# EAGLE design shift octal driver (EAGLE 5.12)
FARNELL: http://uk.farnell.com/nxp/74hct595d/shift-reg-sipo-siso-8bit-16soic/dp/2098004; PARTNO: MCCA000416
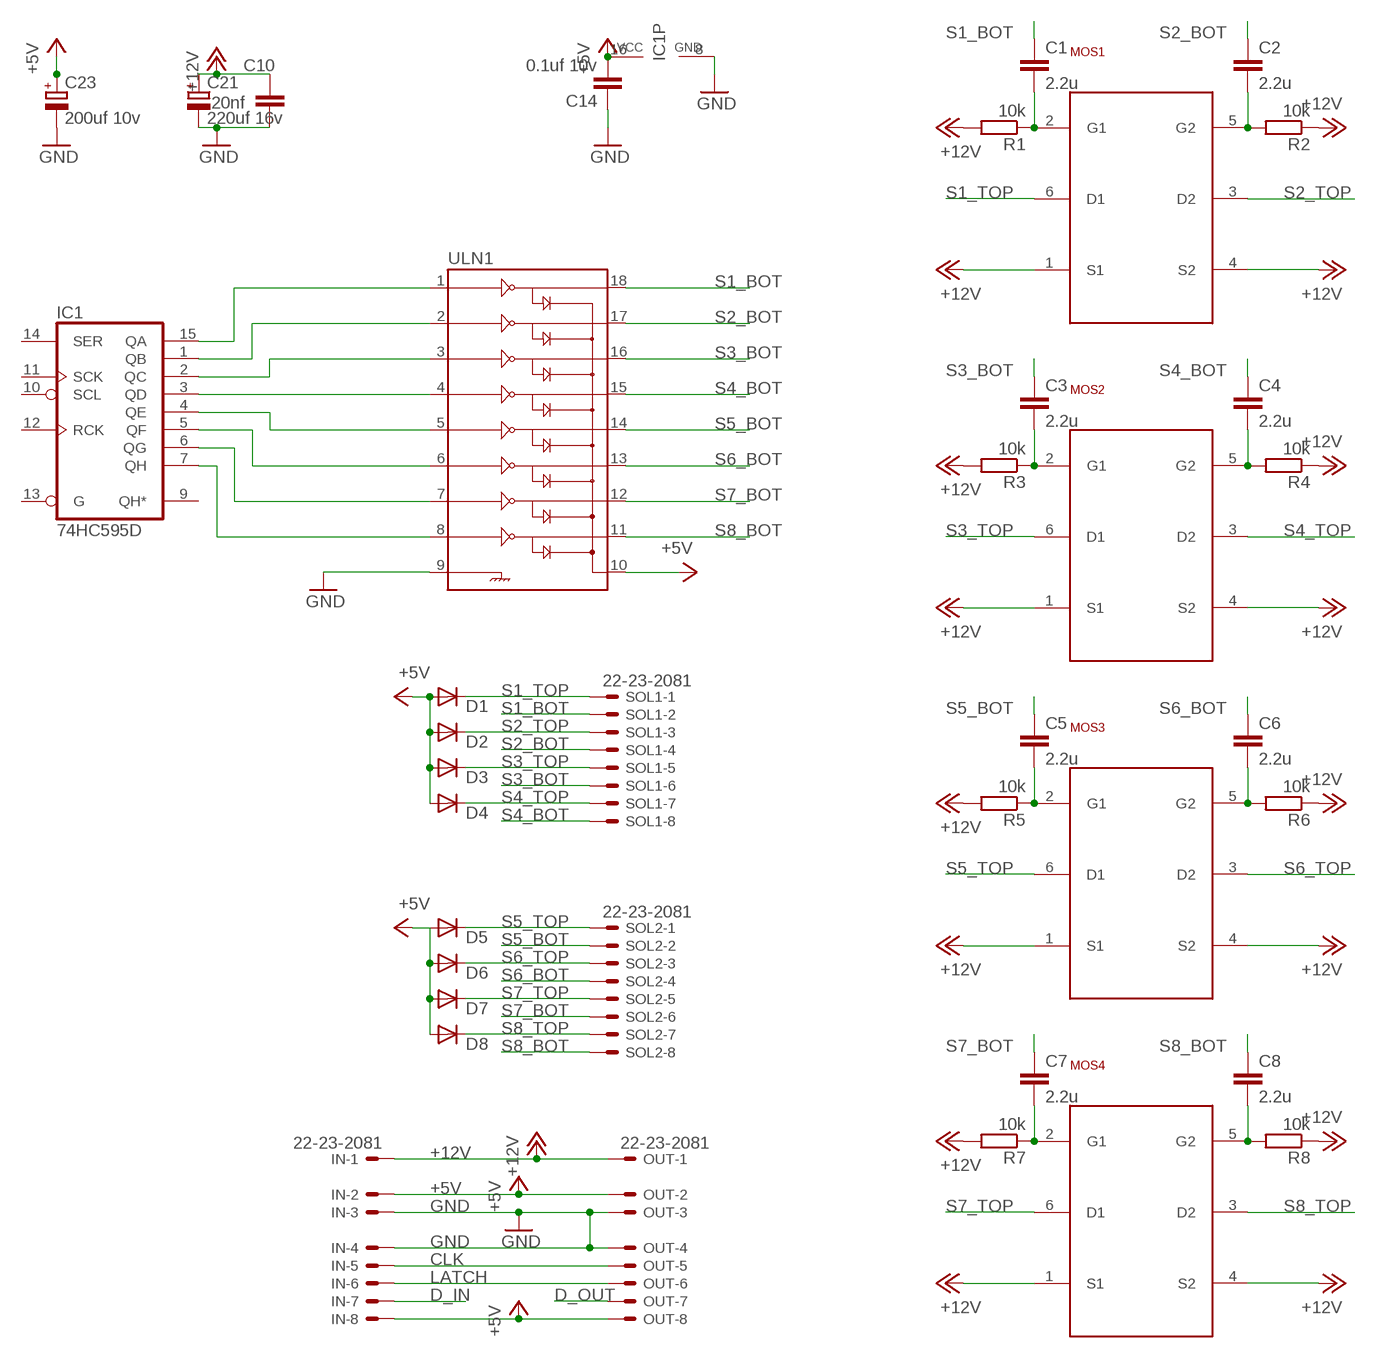
[diagram p0: schematic, sheet 1]

## Parts
C1  2.2u  C-EUC1206  [C1206]
C2  2.2u  C-EUC1206  [C1206]
C3  2.2u  C-EUC1206  [C1206]
C4  2.2u  C-EUC1206  [C1206]
C5  2.2u  C-EUC1206  [C1206]
C6  2.2u  C-EUC1206  [C1206]
C7  2.2u  C-EUC1206  [C1206]
C8  2.2u  C-EUC1206  [C1206]
C10  20nf  C-EUC1206  [C1206]
C14  0.1uf 10v  C-EUC1206  [C1206]
C21  220uf 16v  CPOL-EU153CLV-0810  [153CLV-0810]
C23  200uf 10v  CPOL-EU153CLV-0505  [153CLV-0505]
D1  DIODE-SOD323-W  [SOD323-W]
D2  DIODE-SOD323-W  [SOD323-W]
D3  DIODE-SOD323-W  [SOD323-W]
D4  DIODE-SOD323-W  [SOD323-W]
D5  DIODE-SOD323-W  [SOD323-W]
D6  DIODE-SOD323-W  [SOD323-W]
D7  DIODE-SOD323-W  [SOD323-W]
D8  DIODE-SOD323-W  [SOD323-W]
IC1  74HC595D  [SO16]
IN  22-23-2081  [22-23-2081]
MOS1  PMDT670UPE  [SOT666]
MOS2  PMDT670UPE  [SOT666]
MOS3  PMDT670UPE  [SOT666]
MOS4  PMDT670UPE  [SOT666]
OUT  22-23-2081  [22-23-2081]
R1  10k  R-EU_R1206  [R1206]
R2  10k  R-EU_R1206  [R1206]
R3  10k  R-EU_R1206  [R1206]
R4  10k  R-EU_R1206  [R1206]
R5  10k  R-EU_R1206  [R1206]
R6  10k  R-EU_R1206  [R1206]
R7  10k  R-EU_R1206  [R1206]
R8  10k  R-EU_R1206  [R1206]
SOL1  22-23-2081  [22-23-2081]
SOL2  22-23-2081  [22-23-2081]
ULN1  ULN2803SOIC  [SO018]

## Nets
+5V [power]: C14.2 C23.+ D1.A D2.A D3.A D4.A D5.A D6.A D7.A D8.A IC1.16(VCC) IN.2 IN.8 OUT.2 OUT.8 ULN1.10
+12V [power]: C10.1 C21.+ IN.1 MOS1.1(S1) MOS1.4(S2) MOS2.1(S1) MOS2.4(S2) MOS3.1(S1) MOS3.4(S2) MOS4.1(S1) MOS4.4(S2) OUT.1 R1.2 R2.1 R3.2 R4.1 R5.2 R6.1 R7.2 R8.1
CLK: IN.5 OUT.5
D_IN: IN.7
D_OUT: OUT.7
GND [gnd]: C10.2 C14.1 C21.- C23.- IC1.8(GND) IN.3 IN.4 OUT.3 OUT.4 ULN1.9
LATCH: IN.6 OUT.6
N$1: IC1.15(QA) ULN1.1
N$2: IC1.1(QB) ULN1.2
N$3: IC1.2(QC) ULN1.3
N$4: IC1.3(QD) ULN1.4
N$5: IC1.4(QE) ULN1.5
N$6: IC1.5(QF) ULN1.6
N$7: IC1.6(QG) ULN1.7
N$8: IC1.7(QH) ULN1.8
N$9: C1.2 MOS1.2(G1) R1.1
N$10: C2.2 MOS1.5(G2) R2.2
N$11: C3.2 MOS2.2(G1) R3.1
N$12: C4.2 MOS2.5(G2) R4.2
N$13: C5.2 MOS3.2(G1) R5.1
N$14: C6.2 MOS3.5(G2) R6.2
N$15: C7.2 MOS4.2(G1) R7.1
N$16: C8.2 MOS4.5(G2) R8.2
S1_BOT: C1.1 SOL1.2 ULN1.18
S1_TOP: D1.C MOS1.6(D1) SOL1.1
S2_BOT: C2.1 SOL1.4 ULN1.17
S2_TOP: D2.C MOS1.3(D2) SOL1.3
S3_BOT: C3.1 SOL1.6 ULN1.16
S3_TOP: D3.C MOS2.6(D1) SOL1.5
S4_BOT: C4.1 SOL1.8 ULN1.15
S4_TOP: D4.C MOS2.3(D2) SOL1.7
S5_BOT: C5.1 SOL2.2 ULN1.14
S5_TOP: D5.C MOS3.6(D1) SOL2.1
S6_BOT: C6.1 SOL2.4 ULN1.13
S6_TOP: D6.C MOS3.3(D2) SOL2.3
S7_BOT: C7.1 SOL2.6 ULN1.12
S7_TOP: D7.C MOS4.6(D1) SOL2.5
S8_BOT: C8.1 SOL2.8 ULN1.11
S8_TOP: D8.C MOS4.3(D2) SOL2.7
Unconnected: IC1.9(QH*) IC1.10(SCL) IC1.11(SCK) IC1.12(RCK) IC1.13(G) IC1.14(SER)

## Library data of the parts
C1-C8 = matt rcl:C-EU: CAPACITOR, European symbol
C10 C14 = resistor:C-EU: CAPACITOR, European symbol
C21 = matt rcl:CPOL-EU: POLARIZED CAPACITOR, European symbol
C23 = rcl:CPOL-EU: POLARIZED CAPACITOR, European symbol
D1-D8 = matt diode:DIODE-: DIODE
IC1 = 74xx-eu:74*595: 8-bit SHIFT REGISTER, output latch
IN OUT SOL1 SOL2 = con-molex:22-23-2081: .100" (2.54mm) Center Header - 8 Pin; MF: MOLEX; MPN: 22-23-2081; OC_FARNELL: 1756826; OC_NEWARK: 01C7592
MOS1-MOS4 = matt:PMDT670UPE
R1-R8 = matt rcl:R-EU_: RESISTOR, European symbol
ULN1 = SparkFun:ULN2803: Darlington Driver ULN2803 Darlington array. 500mA max per channel, 8-channel package. Spark Fun Electronics SKU : COM-00312

## Net classes
1 power: width 0.508 mm
2 gnd: width 0.508 mm, drill 0.711 mm, clearance 0.203 mm

## Board
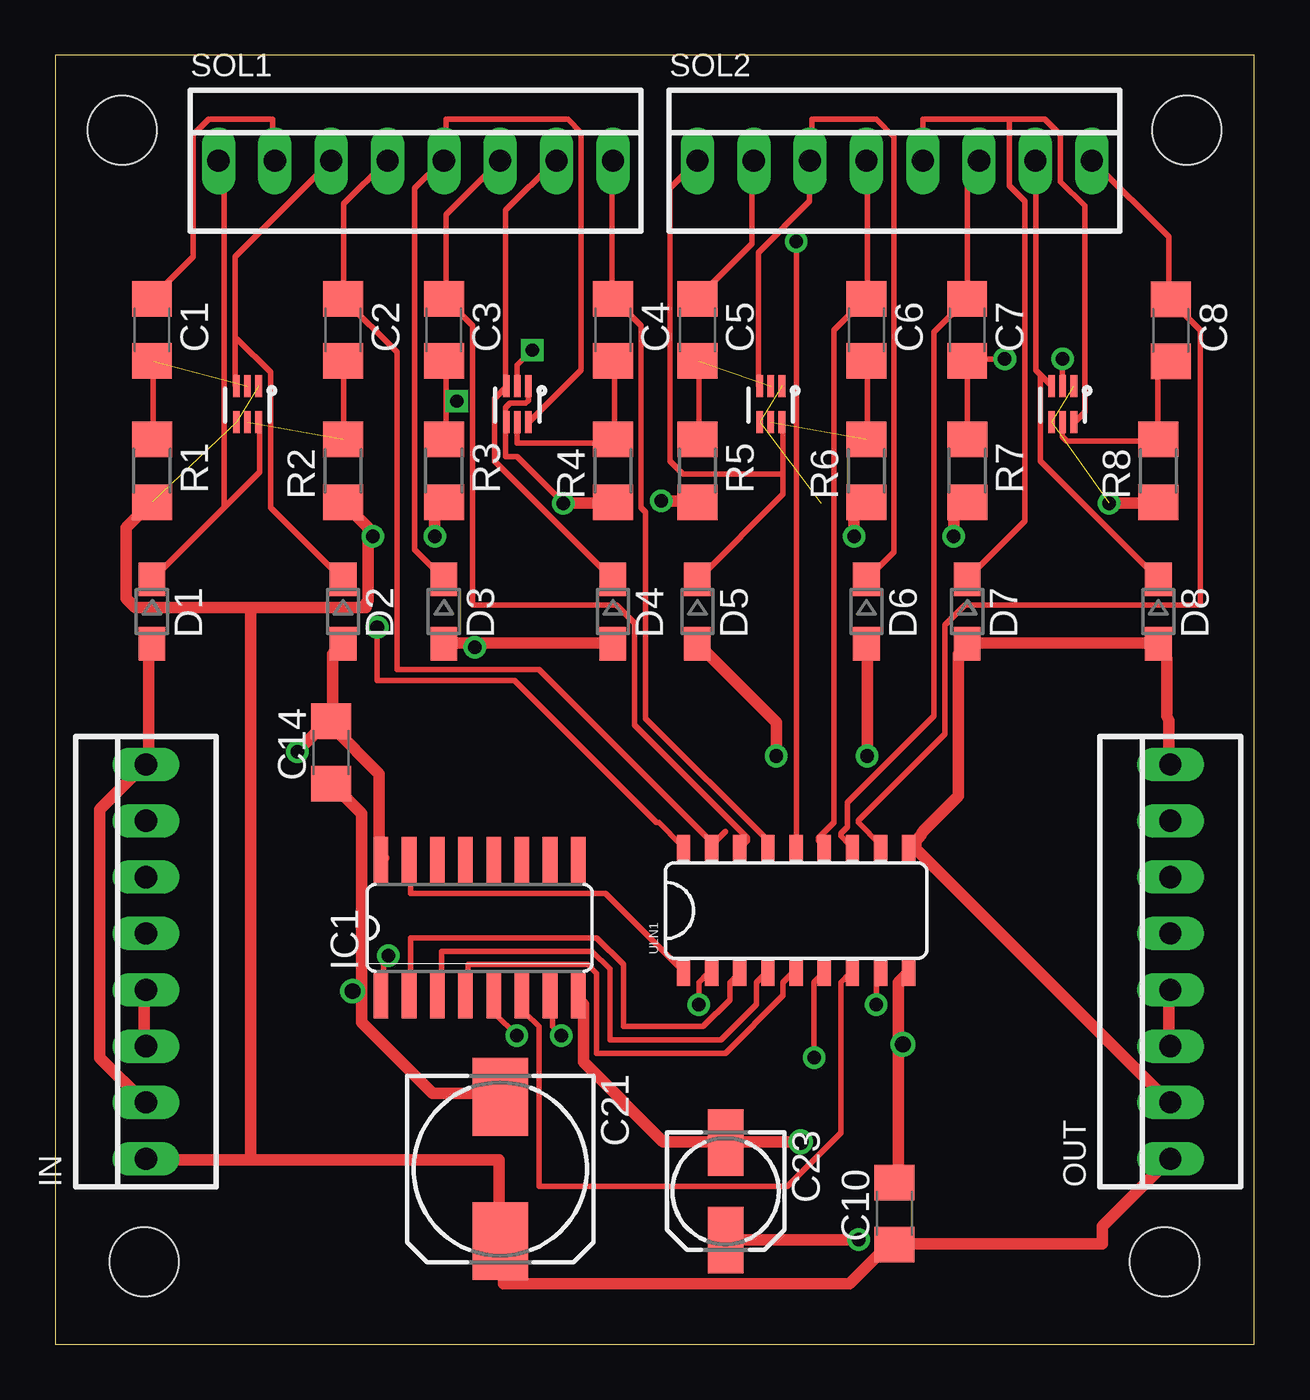
[diagram p1: board, top side]
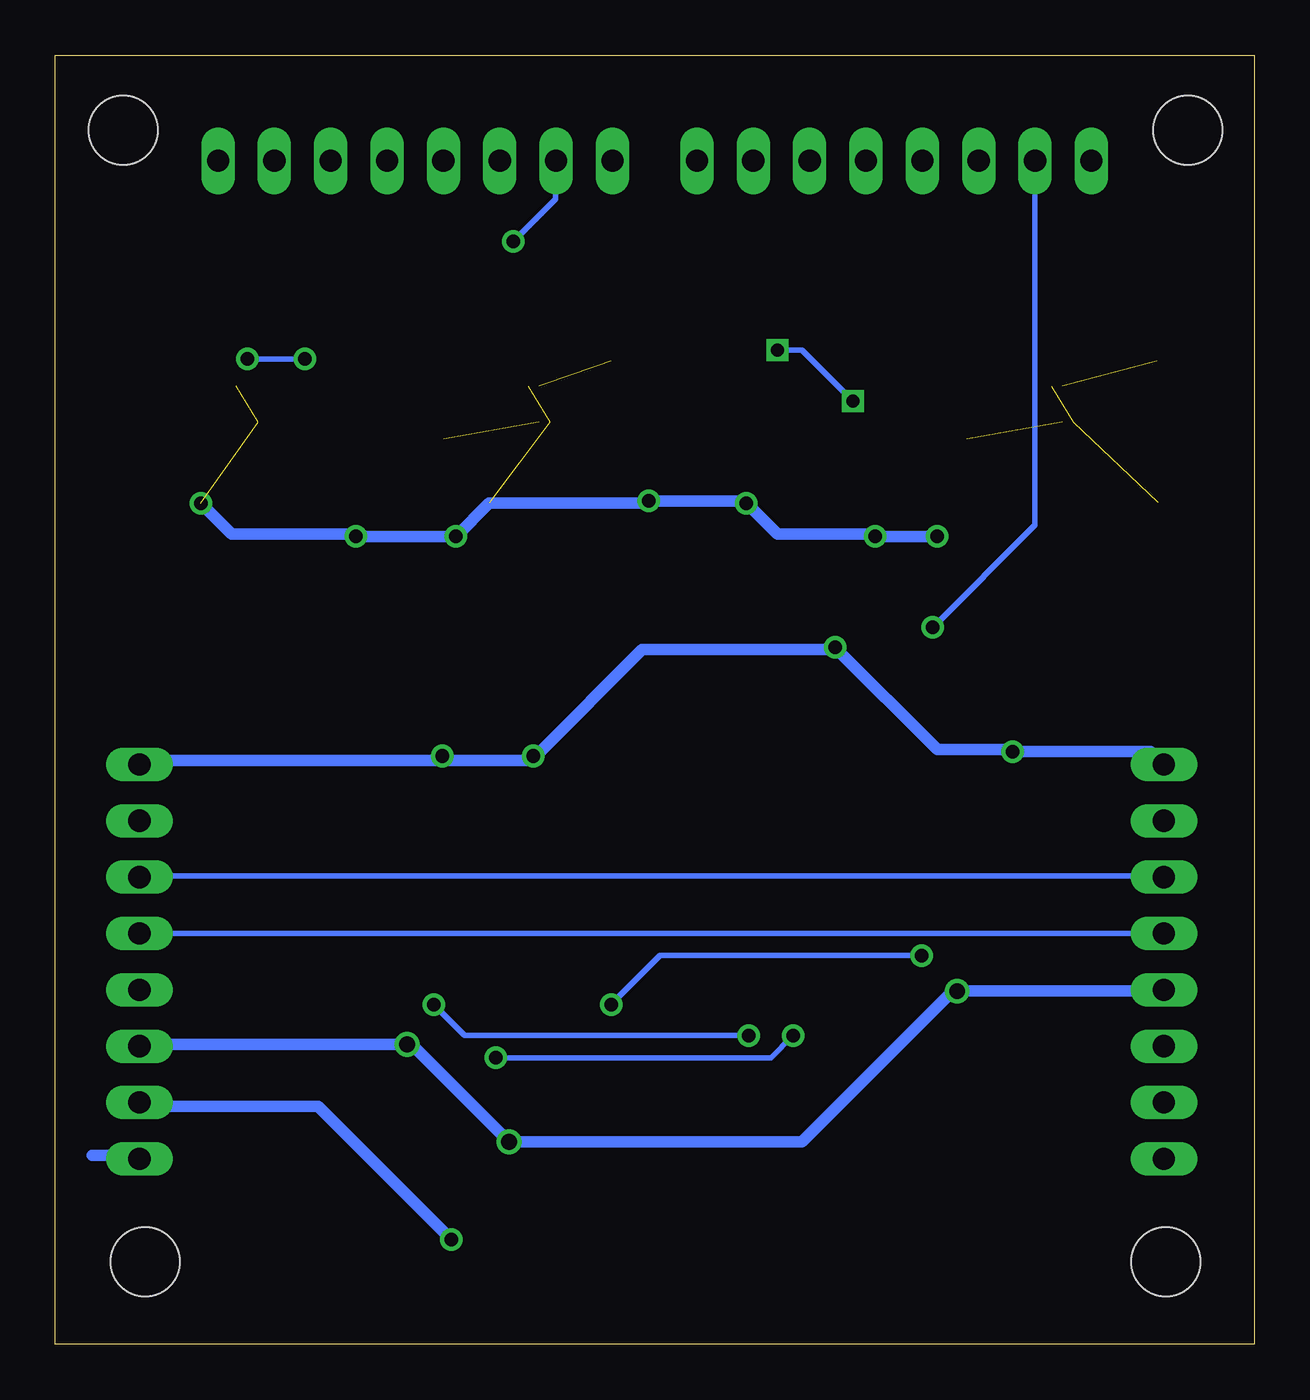
[diagram p2: board, bottom side, seen from below]

Size 54.05 x 58.09 mm. Coordinates in mm from the lower left corner, seen from the top.
Outline: 0,0 54.05,0 54.05,58.09 0,58.09 0,0
Copper layers (1*16): Top 0.035mm / dielectric 1.5mm / Bottom 0.035mm
Design rules "default": minimum track width 10mil, minimum drill 24mil, track to track 8mil, track to pad 8mil, pad to pad 8mil, via to via 8mil, smd to smd 8mil, copper to edge 40mil, drill to drill 8mil, minimum pad ring 10mil, minimum via ring 8mil, stop-mask expansion 4mil, vias tented up to drill 0mil, thermal gap 10mil
Holes 3.1 mm at 3,54.71 51,54.71 50,3.71 4,3.71

### Footprints (pad centres in the part's own frame; a part is rotated, then mirrored left to right if it is on the bottom)
C1206 = smd 1.6 x 1.8: 1 -1.4,0; 2 1.4,0
153CLV-0810 = smd 3.5 x 2.5: + 3.25,0; - -3.25,0
153CLV-0505 = smd 3 x 1.6: + 2.2,0; - -2.2,0
SOD323-W = smd 1.5 x 1.2: A 1.45,0; C -1.45,0
SO16 = smd 0.66 x 2.032: 1 -4.445,-3.073; 2 -3.175,-3.073; 3 -1.905,-3.073; 4 -0.635,-3.073; 5 0.635,-3.073; 6 1.905,-3.073; 7 3.175,-3.073; 8 4.445,-3.073; 9 4.445,3.073; 10 3.175,3.073; 11 1.905,3.073; 12 0.635,3.073; 13 -0.635,3.073; 14 -1.905,3.073; 15 -3.175,3.073; 16 -4.445,3.073
22-23-2081 = drill 1 long: 1 -8.89,0; 2 -6.35,0; 3 -3.81,0; 4 -1.27,0; 5 1.27,0; 6 3.81,0; 7 6.35,0; 8 8.89,0
SOT666 = smd 0.3 x 0.99: 1 0,0; 2 0.5,0; 3 1,0; 4 1,1.61; 5 0.5,1.61; 6 0,1.61
R1206 = smd 1.6 x 1.803: 1 -1.422,0; 2 1.422,0
SO018 = smd 0.6 x 1.2: 1 -5.08,-2.8; 2 -3.81,-2.8; 3 -2.54,-2.8; 4 -1.27,-2.8; 5 0,-2.8; 6 1.27,-2.8; 7 2.54,-2.8; 8 3.81,-2.8; 9 5.08,-2.8; 10 5.08,2.8; 11 3.81,2.8; 12 2.54,2.8; 13 1.27,2.8; 14 0,2.8; 15 -1.27,2.8; 16 -2.54,2.8; 17 -3.81,2.8; 18 -5.08,2.8

### Placement (x,y rotation side)
C1  4.35,45.72 270 top
C2  12.97,45.72 270 top
C3  17.51,45.72 270 top
C4  25.13,45.72 270 top
C5  28.94,45.72 270 top
C6  36.56,45.72 270 top
C7  41.1,45.72 270 top
C8  50.28,45.7 270 top
C10  37.83,5.89 90 top
C14  12.43,26.67 90 top
C21  20.05,7.89 270 top
C23  30.21,6.89 270 top
D1  4.35,33.02 270 top
D2  12.97,33.02 270 top
D3  17.51,33.02 270 top
D4  25.13,33.02 270 top
D5  28.94,33.02 270 top
D6  36.56,33.02 270 top
D7  41.1,33.02 270 top
D8  49.72,33.02 270 top
IC1  19.12,18.76 0 top
IN  4.08,17.24 90 top
MOS1  9.16,43.18 180 top
MOS2  21.32,43.18 180 top
MOS3  32.75,43.18 180 top
MOS4  45.91,43.18 180 top
OUT  50.26,17.24 90 top
R1  4.35,39.37 270 top
R2  12.97,39.37 90 top
R3  17.51,39.37 270 top
R4  25.13,39.37 90 top
R5  28.94,39.37 270 top
R6  36.56,39.37 90 top
R7  41.1,39.37 270 top
R8  49.72,39.37 90 top
SOL1  16.24,53.34 0 top
SOL2  37.83,53.34 0 top
ULN1  33.39,19.54 0 top

### Tracks (layer width: path | path; a pad name or v marks a point on that pad's centre or on a via)
+5V  (via drill 0.61)
  Top 0.508: v36.2,4.71 30.4,4.71 C23.+ | C14.2 12.4,28.11 | 14.8,21.91 IC1.16 14.7,22.11 14.6,22.21 14.6,25.71 12.5,27.81 C14.2 | IN.2 4,10.91 2,12.91 2,24.11 4,26.11 IN.8 4.2,26.31 4.2,31.41 4.3,31.51 D1.A | 38.7,22.61 39,22.91 39.1,23.11 40.7,24.71 40.7,31.11 41,31.41 D7.A 41.1,31.61 49.7,31.61 D8.A 49.7,31.31 50.1,30.91 50.1,28.31 50.2,28.11 50.2,26.31 OUT.8 | 38.7,22.61 38.6,22.51 ULN1.10 | OUT.2 50.2,10.91 38.8,22.31 38.8,22.51 38.7,22.61 | v32.5,26.51 32.5,28.01 D5.A | v36.6,26.51 36.6,31.51 D6.A | 18.9,31.61 25.1,31.61 D4.A | 18.9,31.61 17.6,31.61 D3.A | D2.A 12.9,31.51 12.5,31.11 12.5,28.31 C14.2 | v10.9,26.71 12.2,28.01 C14.2 | v18.9,31.41 18.9,31.61
  Bottom 0.508: v36.2,4.71 42.2,10.71 50.2,10.71 OUT.2 | 36.6,26.31 32.6,26.31 v32.5,26.51 32.3,26.61 27.6,31.31 19.1,31.31 v18.9,31.41 14.3,26.81 11.1,26.81 v10.9,26.71 4.7,26.71 4.4,26.41 IN.8 4.2,26.31 | 36.6,26.31 50.2,26.31 OUT.8 | 36.6,26.31 v36.6,26.51
+12V  (via drill 0.61)  (6 unrouted)
  Top 0.254: v22.9,37.91 20.8,40.01 20.3,40.01 20.3,41.57 MOS2.4 20.3,41.59 20.3,42.21 20.5,42.41 21.2,42.41 21.32,42.53 MOS2.1
  Top 0.508: OUT.1 50.2,8.31 47.2,5.31 47.2,4.51 38,4.51 C10.1 37.6,4.51 35.8,2.71 20.2,2.71 20.2,4.51 C21.+ 20,4.71 20,8.31 8.8,8.31 | 8.8,8.31 4.2,8.31 IN.1 | 8.8,33.21 14,33.21 14,33.41 14.1,33.51 14.1,36.41 | 8.8,33.21 3.6,33.21 3.2,33.61 3.2,36.81 4.3,37.91 R1.2 | 14.1,36.41 14.1,36.81 13,37.91 R2.1 | v17.1,36.41 17.1,37.51 17.5,37.91 R3.2 | 14.1,36.41 v14.3,36.41 | v22.9,37.91 25.1,37.91 R4.1 | v27.3,38.01 28.9,38.01 R5.2 | v36,36.41 36,37.41 36.5,37.91 R6.1 | v40.5,36.41 40.5,37.31 41.1,37.91 R7.2 | v47.5,37.91 49.7,37.91 R8.1 | 8.8,8.31 8.8,33.21
  Bottom 0.508: 52.4,8.51 50.4,8.51 OUT.1 | v14.3,36.41 v17.1,36.41 17.3,36.51 21.5,36.51 v22.9,37.91 23.1,38.01 v27.3,38.01 27.5,37.91 34.5,37.91 v36,36.41 v40.5,36.41 40.7,36.51 46.1,36.51 v47.5,37.91
CLK
  Bottom 0.254: IN.5 OUT.5
GND  (via drill 0.71)
  Top 0.508: IN.3 4,13.51 4,15.91 IN.4 | 13.8,15.91 13.8,14.51 17,11.31 20,11.31 C21.- | 13.8,15.91 13.8,23.91 12.6,25.11 C14.1 | v13.4,15.91 13.8,15.91 | IC1.8 23.6,15.51 23.8,15.31 23.8,12.71 27.4,9.11 30.2,9.11 C23.- 30.4,9.11 v33.6,9.11 | OUT.3 50.2,13.51 50.2,15.91 OUT.4 | 38,13.51 38,7.31 C10.2 | 38,13.51 38,16.31 38.4,16.71 ULN1.9 | v38.2,13.51 38,13.51
  Bottom 0.508: IN.4 4.2,15.91 v13.4,15.91 13.6,15.91 20.4,9.11 v33.6,9.11 38,13.51 v38.2,13.51 50.2,13.51 OUT.3
LATCH
  Bottom 0.254: IN.6 4.2,21.11 50.2,21.11 OUT.6
N$1
  Top 0.254: ULN1.1 28.2,16.91 24.8,20.31 16,20.31 16,21.71 IC1.15
N$2  (via drill 0.61)
  Top 0.254: v29,15.31 29,16.31 29.4,16.71 ULN1.2 | v15,17.51 14.8,17.31 14.8,15.71 IC1.1
  Bottom 0.254: v29,15.31 26.8,17.51 v15,17.51
N$3
  Top 0.254: ULN1.3 30.8,16.71 30.4,16.31 30.4,15.51 29.2,14.31 25.6,14.31 25.6,17.11 24.4,18.31 16,18.31 16,15.71 IC1.2
N$4
  Top 0.254: ULN1.4 32,16.71 31.6,16.31 31.6,15.31 30,13.71 25,13.71 25,16.91 24.2,17.71 17.4,17.71 17.4,15.71 IC1.3
N$5
  Top 0.254: ULN1.5 33.2,16.71 32.8,16.31 32.8,15.71 30.2,13.11 24.4,13.11 24.4,16.71 24,17.11 18.6,17.11 18.6,15.71 IC1.4
N$6  (via drill 0.61)
  Top 0.254: v34.2,12.91 34.2,16.31 34.6,16.71 ULN1.6 | v20.8,13.91 19.8,14.91 19.8,15.51 IC1.5
  Bottom 0.254: v34.2,12.91 21.8,12.91 v20.8,13.91
N$7
  Top 0.254: ULN1.7 35.8,16.71 35.4,16.31 35.4,9.51 33,7.11 21.8,7.11 21.8,14.31 21.2,14.91 21.2,15.51 IC1.6
N$8  (via drill 0.61)
  Top 0.254: v37,15.31 37,16.51 37.2,16.71 ULN1.8 | v22.8,13.91 22.4,14.31 22.4,15.51 IC1.7
  Bottom 0.254: v37,15.31 35.6,13.91 v22.8,13.91
N$9  (1 unrouted)
  Top 0.254: C1.2 4.4,44.31 4.4,40.81 R1.1
N$10  (1 unrouted)
  Top 0.254: C2.2 13,44.31 13,40.81 R2.2
N$11  (via drill 0.6)
  Top 0.254: 17.6,42.71 17.6,40.81 R3.1 | 17.6,42.71 17.6,44.31 C3.2 | MOS2.2 20.82,44.13 v21.5,44.81 | v18.1,42.51 17.8,42.51 17.6,42.71
  Bottom 0.254: v21.5,44.81 20.4,44.81 v18.1,42.51
N$12
  Top 0.254: C4.2 25.2,44.31 25.2,40.81 R4.2 25.13,40.61 20.8,40.61 20.8,41.57 MOS2.5
N$13  (1 unrouted)
  Top 0.254: C5.2 29,44.31 29,40.81 R5.1
N$14  (1 unrouted)
  Top 0.254: C6.2 36.6,44.31 36.6,40.81 R6.2
N$15  (via drill 0.61)
  Top 0.254: v45.4,44.41 45.4,43.21 MOS4.2 | v42.8,44.41 41.1,44.41 C7.2 R7.1
  Bottom 0.254: v42.8,44.41 v45.4,44.41
N$16
  Top 0.254: MOS4.5 45.4,41.51 45.4,40.91 45.6,40.71 49.7,40.71 R8.2 49.7,40.91 49.7,43.71 50.2,44.21 C8.2
S1_BOT  (via drill 0.61)
  Top 0.254: ULN1.18 28.2,22.51 27.2,23.51 27.1,23.51 20.7,29.91 14.5,29.91 v14.5,32.31 | C1.1 4.4,47.21 6.2,49.01 6.2,54.51 6.9,55.21 9.8,55.21 9.8,53.41 SOL1.2
  Bottom 0.254: v14.5,32.31 9.9,36.91 9.9,53.31 SOL1.2
S1_TOP
  Top 0.254: 7.65,37.76 4.4,34.51 D1.C | 7.65,37.76 9.2,39.31 9.2,41.51 MOS1.6 | SOL1.1 7.4,53.31 7.6,53.11 7.6,37.81 7.65,37.76
S2_BOT
  Top 0.254: 30.2,23.11 29.6,22.51 ULN1.17 29.6,22.61 21.8,30.41 15.4,30.41 15.4,44.71 13,47.11 C2.1 13,47.21 13,51.41 14.9,53.31 SOL1.4
S2_TOP
  Top 0.254: 8.1,45.31 8.1,49.01 SOL1.3 | 8.1,45.31 8.1,43.21 MOS1.3 | D2.C 12.9,34.51 9.7,37.71 9.7,43.81 8.2,45.31 8.1,45.31
S3_BOT
  Top 0.254: ULN1.16 31,22.51 31.2,22.71 31.2,22.81 26.1,27.91 26.1,32.51 25.3,33.31 18.8,33.31 18.8,45.91 17.6,47.11 C3.1 17.6,47.21 17.6,50.91 20,53.31 SOL1.6
S3_TOP
  Top 0.254: MOS2.6 21.4,41.61 23.7,43.91 23.7,54.61 23.1,55.21 17.6,55.21 17.6,53.41 SOL1.5 17.4,53.31 16.2,52.11 16.2,35.81 17.5,34.51 D3.C
S4_BOT
  Top 0.254: 32.2,22.51 ULN1.15 32.2,22.61 26.6,28.21 26.6,37.51 26.4,37.71 26.4,45.91 25.2,47.11 C4.1 25.1,47.21 25.1,53.31 SOL1.8
S4_TOP
  Top 0.254: SOL1.7 22.5,53.31 20.3,51.11 20.3,43.21 MOS2.3 20.3,43.11 19.8,42.61 19.8,39.81 25.1,34.51 D4.C
S5_BOT  (via drill 0.61)
  Top 0.254: 33.4,22.51 ULN1.14 33.4,22.61 v33.4,49.71 | C5.1 29,47.21 31.4,49.61 31.4,53.31 SOL2.2
  Bottom 0.254: v33.4,49.71 31.5,51.61 31.5,53.31 SOL2.2
S5_TOP
  Top 0.254: 32.8,39.21 32.8,38.31 29,34.51 D5.C | 32.8,39.21 32.8,41.51 MOS3.6 | SOL2.1 28.9,53.31 27.7,52.11 27.7,39.81 28.3,39.21 32.8,39.21
S6_BOT
  Top 0.254: 34.4,22.71 34.6,22.51 ULN1.13 34.4,22.81 35.1,23.51 35.1,45.71 36.5,47.11 C6.1 36.6,47.21 36.6,53.31 SOL2.4
S6_TOP
  Top 0.254: MOS3.3 31.7,43.21 31.7,49.21 34,51.51 34,53.31 SOL2.3 34.1,53.41 34.1,55.21 37,55.21 37.8,54.41 37.8,35.71 D6.C
S7_BOT
  Top 0.254: ULN1.12 35.8,22.51 35.4,22.91 35.4,23.01 35.7,23.31 35.7,24.41 39.6,28.31 39.6,45.61 C7.1 41.1,52.81 41.6,53.31 SOL2.6
S7_TOP
  Top 0.254: 43,55.21 39.1,55.21 SOL2.5 | 43,55.21 44.6,55.21 45.3,54.51 45.3,52.41 46.4,51.31 46.4,42.01 46,41.61 MOS4.6 | D7.C 41.1,34.51 43.7,37.11 43.7,51.51 43,52.21 43,55.21
S8_BOT
  Top 0.254: ULN1.11 37.2,22.51 36.2,23.51 36.2,23.61 40.1,27.51 40.1,32.41 41,33.31 51.6,33.31 51.6,45.71 50.3,47.01 C8.1 50.2,47.21 50.2,49.91 46.8,53.31 SOL2.8
S8_TOP
  Top 0.254: 44.45,43.66 44.2,43.91 44.2,53.31 SOL2.7 | 44.45,43.66 44.9,43.21 MOS4.3 | D8.C 49.7,34.51 44.4,39.81 44.4,43.61 44.45,43.66